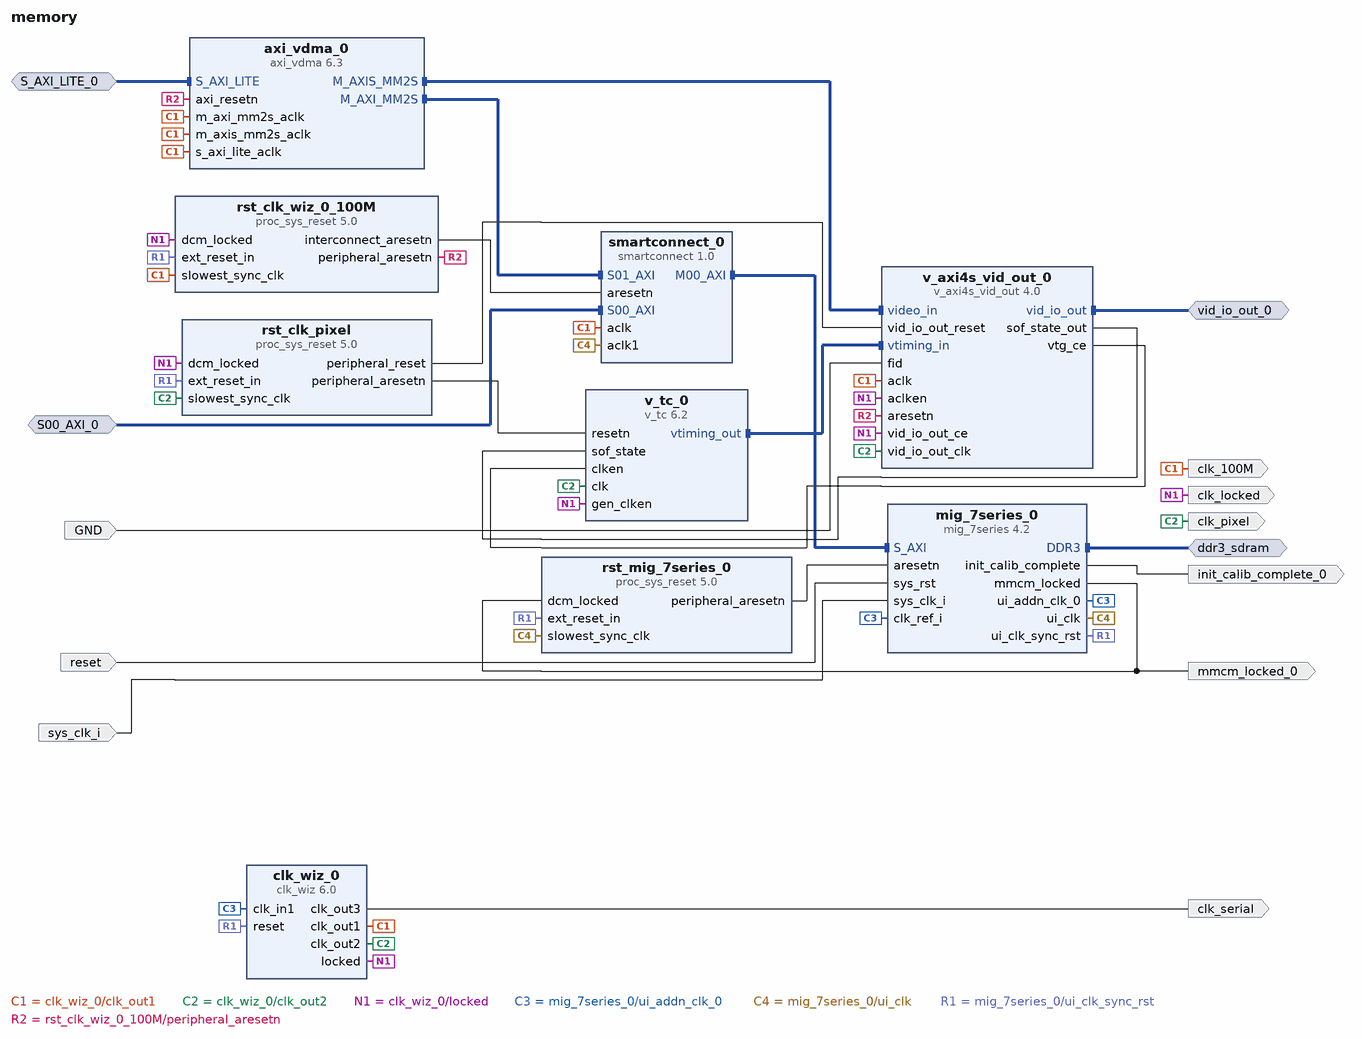
[diagram p0: block diagram of the top level]
# Vivado block design memory, xc7s25csga324-1, Vivado 2025.2
create_bd_design memory

create_bd_intf_port -mode Master -vlnv xilinx.com:interface:ddrx_rtl:1.0 ddr3_sdram
create_bd_intf_port -mode Master -vlnv xilinx.com:interface:vid_io_rtl:1.0 vid_io_out_0
create_bd_intf_port -mode Slave -vlnv xilinx.com:interface:aximm_rtl:1.0 S00_AXI_0
set_property -dict [list \
  CONFIG.ADDR_WIDTH 32 \
  CONFIG.ARUSER_WIDTH 0 \
  CONFIG.AWUSER_WIDTH 0 \
  CONFIG.BUSER_WIDTH 0 \
  CONFIG.DATA_WIDTH 32 \
  CONFIG.HAS_BRESP 1 \
  CONFIG.HAS_BURST 1 \
  CONFIG.HAS_CACHE 1 \
  CONFIG.HAS_LOCK 1 \
  CONFIG.HAS_PROT 1 \
  CONFIG.HAS_QOS 1 \
  CONFIG.HAS_REGION 0 \
  CONFIG.HAS_RRESP 1 \
  CONFIG.HAS_WSTRB 1 \
  CONFIG.ID_WIDTH 0 \
  CONFIG.MAX_BURST_LENGTH 256 \
  CONFIG.NUM_READ_OUTSTANDING 1 \
  CONFIG.NUM_READ_THREADS 1 \
  CONFIG.NUM_WRITE_OUTSTANDING 1 \
  CONFIG.NUM_WRITE_THREADS 1 \
  CONFIG.PROTOCOL AXI4 \
  CONFIG.READ_WRITE_MODE READ_WRITE \
  CONFIG.RUSER_BITS_PER_BYTE 0 \
  CONFIG.RUSER_WIDTH 0 \
  CONFIG.SUPPORTS_NARROW_BURST 1 \
  CONFIG.WUSER_BITS_PER_BYTE 0 \
  CONFIG.WUSER_WIDTH 0 \
] [get_bd_intf_ports S00_AXI_0]
create_bd_intf_port -mode Slave -vlnv xilinx.com:interface:aximm_rtl:1.0 S_AXI_LITE_0
set_property -dict [list \
  CONFIG.ADDR_WIDTH 16 \
  CONFIG.ARUSER_WIDTH 0 \
  CONFIG.AWUSER_WIDTH 0 \
  CONFIG.BUSER_WIDTH 0 \
  CONFIG.DATA_WIDTH 32 \
  CONFIG.HAS_BRESP 1 \
  CONFIG.HAS_BURST 0 \
  CONFIG.HAS_CACHE 0 \
  CONFIG.HAS_LOCK 0 \
  CONFIG.HAS_PROT 0 \
  CONFIG.HAS_QOS 0 \
  CONFIG.HAS_REGION 0 \
  CONFIG.HAS_RRESP 1 \
  CONFIG.HAS_WSTRB 0 \
  CONFIG.ID_WIDTH 0 \
  CONFIG.NUM_READ_OUTSTANDING 1 \
  CONFIG.NUM_READ_THREADS 1 \
  CONFIG.NUM_WRITE_OUTSTANDING 1 \
  CONFIG.NUM_WRITE_THREADS 1 \
  CONFIG.PROTOCOL AXI4LITE \
  CONFIG.READ_WRITE_MODE READ_WRITE \
  CONFIG.RUSER_BITS_PER_BYTE 0 \
  CONFIG.RUSER_WIDTH 0 \
  CONFIG.WUSER_BITS_PER_BYTE 0 \
  CONFIG.WUSER_WIDTH 0 \
] [get_bd_intf_ports S_AXI_LITE_0]
create_bd_port -dir I -type clk sys_clk_i
create_bd_port -dir O init_calib_complete_0
create_bd_port -dir O mmcm_locked_0
create_bd_port -dir I GND
create_bd_port -dir O -type clk clk_100M
set_property -dict {CONFIG.ASSOCIATED_BUSIF S00_AXI_0:S_AXI_LITE_0} [get_bd_ports clk_100M]
create_bd_port -dir O -type clk clk_pixel
create_bd_port -dir O -type clk clk_serial
create_bd_port -dir O clk_locked
create_bd_port -dir I -type rst reset
set_property -dict {CONFIG.POLARITY ACTIVE_LOW} [get_bd_ports reset]

create_bd_cell -type ip -vlnv xilinx.com:ip:mig_7series:4.2 mig_7series_0
set_property -dict {CONFIG.BOARD_MIG_PARAM ddr3_sdram CONFIG.RESET_BOARD_INTERFACE reset} [get_bd_cells mig_7series_0]
create_bd_cell -type ip -vlnv xilinx.com:ip:smartconnect:1.0 smartconnect_0
set_property -dict {CONFIG.NUM_CLKS 2} [get_bd_cells smartconnect_0]
create_bd_cell -type ip -vlnv xilinx.com:ip:axi_vdma:6.3 axi_vdma_0
set_property -dict [list \
  CONFIG.c_include_s2mm 0 \
  CONFIG.c_m_axi_mm2s_data_width 32 \
  CONFIG.c_mm2s_linebuffer_depth 2048 \
  CONFIG.c_mm2s_max_burst_length 64 \
  CONFIG.c_num_fstores 2 \
] [get_bd_cells axi_vdma_0]
create_bd_cell -type ip -vlnv xilinx.com:ip:clk_wiz:6.0 clk_wiz_0
set_property -dict [list \
  CONFIG.CLKOUT1_JITTER 180.646 \
  CONFIG.CLKOUT1_PHASE_ERROR 204.065 \
  CONFIG.CLKOUT2_JITTER 189.209 \
  CONFIG.CLKOUT2_PHASE_ERROR 204.065 \
  CONFIG.CLKOUT2_REQUESTED_OUT_FREQ 74.25 \
  CONFIG.CLKOUT2_REQUESTED_PHASE 0.000 \
  CONFIG.CLKOUT2_USED true \
  CONFIG.CLKOUT3_JITTER 147.616 \
  CONFIG.CLKOUT3_PHASE_ERROR 204.065 \
  CONFIG.CLKOUT3_REQUESTED_OUT_FREQ 371.25 \
  CONFIG.CLKOUT3_USED true \
  CONFIG.MMCM_CLKFBOUT_MULT_F 39.000 \
  CONFIG.MMCM_CLKOUT0_DIVIDE_F 11.125 \
  CONFIG.MMCM_CLKOUT1_DIVIDE 15 \
  CONFIG.MMCM_CLKOUT1_PHASE 0.000 \
  CONFIG.MMCM_CLKOUT2_DIVIDE 3 \
  CONFIG.NUM_OUT_CLKS 3 \
] [get_bd_cells clk_wiz_0]
create_bd_cell -type ip -vlnv xilinx.com:ip:v_axi4s_vid_out:4.0 v_axi4s_vid_out_0
set_property -dict {CONFIG.C_HAS_ASYNC_CLK 1 CONFIG.C_S_AXIS_VIDEO_FORMAT 6} [get_bd_cells v_axi4s_vid_out_0]
create_bd_cell -type ip -vlnv xilinx.com:ip:v_tc:6.2 v_tc_0
set_property -dict {CONFIG.HAS_AXI4_LITE false CONFIG.enable_detection false} [get_bd_cells v_tc_0]
create_bd_cell -type ip -vlnv xilinx.com:ip:proc_sys_reset:5.0 rst_clk_wiz_0_100M
create_bd_cell -type ip -vlnv xilinx.com:ip:proc_sys_reset:5.0 rst_mig_7series_0
create_bd_cell -type ip -vlnv xilinx.com:ip:proc_sys_reset:5.0 rst_clk_pixel

# ---- connections ----

connect_bd_intf_net -intf_net S00_AXI_0_1 [get_bd_intf_ports S00_AXI_0] [get_bd_intf_pins smartconnect_0/S00_AXI]
connect_bd_intf_net -intf_net S_AXI_LITE_0_1 [get_bd_intf_ports S_AXI_LITE_0] [get_bd_intf_pins axi_vdma_0/S_AXI_LITE]
connect_bd_intf_net [get_bd_intf_pins axi_vdma_0/M_AXIS_MM2S] [get_bd_intf_pins v_axi4s_vid_out_0/video_in]
connect_bd_intf_net [get_bd_intf_pins smartconnect_0/S01_AXI] [get_bd_intf_pins axi_vdma_0/M_AXI_MM2S]
connect_bd_intf_net [get_bd_intf_ports ddr3_sdram] [get_bd_intf_pins mig_7series_0/DDR3]
connect_bd_intf_net [get_bd_intf_pins smartconnect_0/M00_AXI] [get_bd_intf_pins mig_7series_0/S_AXI]
connect_bd_intf_net [get_bd_intf_ports vid_io_out_0] [get_bd_intf_pins v_axi4s_vid_out_0/vid_io_out]
connect_bd_intf_net [get_bd_intf_pins v_tc_0/vtiming_out] [get_bd_intf_pins v_axi4s_vid_out_0/vtiming_in]
connect_bd_net [get_bd_pins clk_wiz_0/clk_out1] \
  [get_bd_pins axi_vdma_0/m_axi_mm2s_aclk] [get_bd_pins smartconnect_0/aclk] [get_bd_pins axi_vdma_0/m_axis_mm2s_aclk] \
  [get_bd_pins v_axi4s_vid_out_0/aclk] [get_bd_pins rst_clk_wiz_0_100M/slowest_sync_clk] \
  [get_bd_pins axi_vdma_0/s_axi_lite_aclk] [get_bd_ports clk_100M]
connect_bd_net [get_bd_pins clk_wiz_0/clk_out2] \
  [get_bd_pins v_axi4s_vid_out_0/vid_io_out_clk] [get_bd_ports clk_pixel] [get_bd_pins rst_clk_pixel/slowest_sync_clk] \
  [get_bd_pins v_tc_0/clk]
connect_bd_net [get_bd_pins clk_wiz_0/clk_out3] [get_bd_ports clk_serial]
connect_bd_net [get_bd_pins clk_wiz_0/locked] \
  [get_bd_pins rst_clk_wiz_0_100M/dcm_locked] [get_bd_pins v_axi4s_vid_out_0/vid_io_out_ce] \
  [get_bd_pins v_axi4s_vid_out_0/aclken] [get_bd_pins v_tc_0/gen_clken] [get_bd_pins rst_clk_pixel/dcm_locked] \
  [get_bd_ports clk_locked]
connect_bd_net -net fid_0_1 [get_bd_ports GND] [get_bd_pins v_axi4s_vid_out_0/fid]
connect_bd_net [get_bd_pins mig_7series_0/init_calib_complete] [get_bd_ports init_calib_complete_0]
connect_bd_net [get_bd_pins mig_7series_0/mmcm_locked] [get_bd_ports mmcm_locked_0] [get_bd_pins rst_mig_7series_0/dcm_locked]
connect_bd_net [get_bd_pins mig_7series_0/ui_addn_clk_0] [get_bd_pins mig_7series_0/clk_ref_i] [get_bd_pins clk_wiz_0/clk_in1]
connect_bd_net [get_bd_pins mig_7series_0/ui_clk] [get_bd_pins smartconnect_0/aclk1] [get_bd_pins rst_mig_7series_0/slowest_sync_clk]
connect_bd_net [get_bd_pins mig_7series_0/ui_clk_sync_rst] \
  [get_bd_pins clk_wiz_0/reset] [get_bd_pins rst_clk_wiz_0_100M/ext_reset_in] [get_bd_pins rst_mig_7series_0/ext_reset_in] \
  [get_bd_pins rst_clk_pixel/ext_reset_in]
connect_bd_net [get_bd_ports reset] [get_bd_pins mig_7series_0/sys_rst]
connect_bd_net [get_bd_pins rst_clk_pixel/peripheral_aresetn] [get_bd_pins v_tc_0/resetn]
connect_bd_net [get_bd_pins rst_clk_pixel/peripheral_reset] [get_bd_pins v_axi4s_vid_out_0/vid_io_out_reset]
connect_bd_net [get_bd_pins rst_clk_wiz_0_100M/interconnect_aresetn] [get_bd_pins smartconnect_0/aresetn]
connect_bd_net [get_bd_pins rst_clk_wiz_0_100M/peripheral_aresetn] [get_bd_pins axi_vdma_0/axi_resetn] [get_bd_pins v_axi4s_vid_out_0/aresetn]
connect_bd_net [get_bd_pins rst_mig_7series_0/peripheral_aresetn] [get_bd_pins mig_7series_0/aresetn]
connect_bd_net [get_bd_ports sys_clk_i] [get_bd_pins mig_7series_0/sys_clk_i]
connect_bd_net [get_bd_pins v_axi4s_vid_out_0/sof_state_out] [get_bd_pins v_tc_0/sof_state]
connect_bd_net [get_bd_pins v_axi4s_vid_out_0/vtg_ce] [get_bd_pins v_tc_0/clken]

# ---- address map ----
assign_bd_address -offset 0x80000000 -range 256M -target_address_space [get_bd_addr_spaces axi_vdma_0/Data_MM2S] [get_bd_addr_segs mig_7series_0/memmap/memaddr]
assign_bd_address -offset 0x80000000 -range 256M -target_address_space [get_bd_addr_spaces S00_AXI_0] [get_bd_addr_segs mig_7series_0/memmap/memaddr]
assign_bd_address -offset 0x0000 -range 256 -target_address_space [get_bd_addr_spaces S_AXI_LITE_0] [get_bd_addr_segs axi_vdma_0/S_AXI_LITE/Reg]

validate_bd_design
save_bd_design
